# Altium project CC.PrjPCB
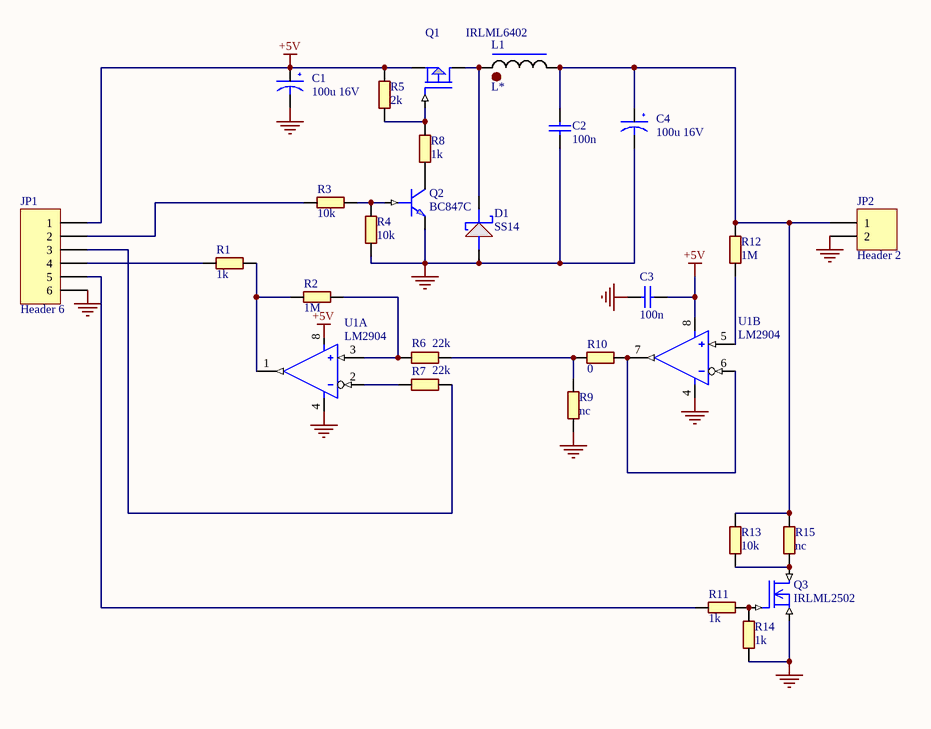
[diagram p0: CC_v00.SchDoc]
1 sheet, 27 parts. Net scope: global (net labels, ports and power ports of the same name join across sheets).
Board file: CC_v00.PcbDoc

## Sheet CC_v00.SchDoc
size 209 x 297 mm; Scale: {Масш.}; Title1str: {Наименование}; PageSetup: Record=PageOptions|CenterHorizontal=False|CenterVertical=False|PrintScale=0.95|XCorrection=0.00|YCorrection=0.00|PrintKind=1|BorderSize=5000000|LeftOffset=0|BottomOffset=0|Orientation=1|PaperLength=1000|PaperWidth=1000|Scale=100|PaperSource=15|PrintQuality=600|MediaType=1|DitherType=10|PaperKind=A4|PrintScaleMode=1; Title2str: {Наименование}; ProcessInspection: {Т.контр.}; Mass: {Масса}; NormInspection: {Н.контр.}; EngineerName: {Инженер}; Letter1Column: {}; Letter2Column: {}; Letter3Column: {}; DocumentType: {Документ}; DocumentType1str: {Документ}; DocumentType2str: {Документ}

### Parts
C1  100u 16V  [CAPPRD200W50D600H1250]
C2  100n  [CAPC1608X08N]
C3  100n  [CAPC1608X08N]
C4  100u 16V  [CAPPRD200W50D600H1250]
D1  SS14  [DIOM521X260X241L114X145N]
JP1  Header 6  [HDRV6W70P254_6X1_1397X254H754]
JP2  Header 2  [HDRV2W64P254_2X1_508X254H854]
L1  L*  [SND-0705]
Q1  IRLML6402  [SOT-23]
Q2  BC847C  [SOT95P245X110-3N]
Q3  IRLML2502  [SOT95P245X110-3N]
R1  1k  [RESC1608X06N]
R2  1M  [RESC1608X06N]
R3  10k  [RESC1608X06N]
R4  10k  [RESC1608X06N]
R5  2k  [RESC1608X06N]
R6  22k  [RESC1608X06N]
R7  22k  [RESC1608X06N]
R8  1k  [RESC1608X06N]
R9  nc  [RESC1608X06N]
R10  0  [RESC1608X06N]
R11  1k  [RESC1608X06N]
R12  1M  [RESC1608X06N]
R13  10k  [RESC1608X06N]
R14  1k  [RESC1608X06N]
R15  nc  [RESC1608X06N]
U1  LM2904  [SOIC127P600X175-8N]  (parts A,B of 2)

### Nets
+5V: C1.2(+) C3.2 JP1.1 Q1.3(SOURCE) R5.2 U1.8(V+)
GND: C1.1(-) C2.2 C3.1 C4.1(-) D1.A JP1.6 JP2.2 Q2.3(EMITTER) Q3.3(S) R4.2 R9.2 R14.1 U1.4(V-)
NetC2_1: C2.1 C4.2(+) JP2.1 L1.2 R12.2 R13.2 R15.2
NetD1_K: D1.K L1.1 Q1.2(DRAIN)
NetJP1_2: JP1.2 R3.2
NetJP1_3: JP1.3 R7.1
NetJP1_4: JP1.4 R1.2
NetJP1_5: JP1.5 R11.2
NetQ1_1: Q1.1(GATE) R5.1 R8.2
NetQ2_1: Q2.1(BASE) R3.1 R4.1
NetQ2_2: Q2.2(COLLECTOR) R8.1
NetQ3_1: Q3.1(G) R11.1 R14.2
NetQ3_2: Q3.2(D) R13.1 R15.1
NetR1_1: R1.1 R2.2 U1.1(OUT)
NetR2_1: R2.1 R6.2 U1.3(+IN)
NetR6_1: R6.1 R9.1 R10.2
NetR7_2: R7.2 U1.2(-IN)
NetR10_1: R10.1 U1.6(-IN) U1.7(OUT)
NetR12_1: R12.1 U1.5(+IN)

### Notes on the sheet
- Labels drawn without touching a wire or pin: +5V
- Перв. примен.
- Справ. №
- Подп. и дата
- Инв. № дубл.
- Взам. инв. №
- Изм.
- Лист
- № докум.
- Подп.
- Дата
- Лит.
- Масса
- Масштаб
- Т.контр.
- Пров.
- Разраб.
- Листов
- Инв. № подл.
- Н.контр.
- Утв.
- Копировал
- Формат А4

### Library data of the parts
C1 C4 = C-EL-DIP: Производитель: *; Точность: *; Напряжение: *; Тип диэлектрика: *
C2 C3 = CAPN
D1 = DIODE SCHOTTKY: Text Field1: 30; Text Field2: 20
JP1 = Header 6: Header, 6-Pin; LatestRevisionDate: 17-Jul-2002; LatestRevisionNote: Re-released for DXP Platform.; Publisher: Altium Limited
JP2 = Header 2: Header, 2-Pin; LatestRevisionDate: 17-Jul-2002; LatestRevisionNote: Re-released for DXP Platform.; Publisher: Altium Limited
Q1 = MOSF-P
Q2 = NPN
Q3 = MFET N
R1-R15 = RES
U1 = LM2904: 2 Operation amplifier; Производитель: *; Допустимая замена: *; Цена: *; PDF файл: *; Температурный диапазон: *